# Altium schematic sheet TOP.SchDoc
size A3; DocumentNumber: 1; SheetNumber: 1; SheetTotal: 15
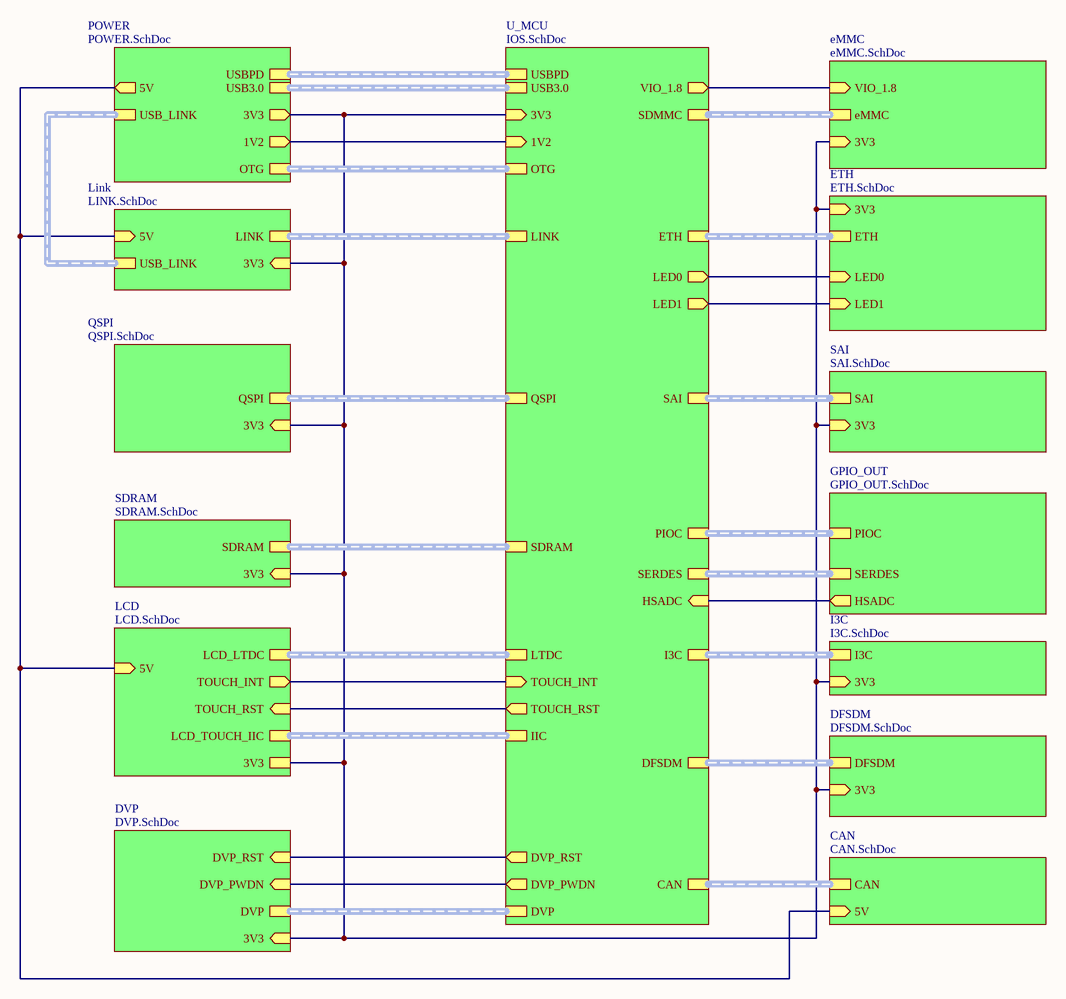
[diagram p0: TOP.SchDoc]

## Sub-sheets
CAN = CAN.SchDoc: CAN (harness CAN), 5V (in)
DFSDM = DFSDM.SchDoc: DFSDM (harness DFSDM), 3V3 (in)
DVP = DVP.SchDoc: DVP (harness DVP), DVP_RST (in), DVP_PWDN (in), 3V3 (in)
eMMC = eMMC.SchDoc: eMMC (harness eMMC), 3V3 (in), VIO_1.8 (in)
ETH = ETH.SchDoc: ETH (harness ETH), LED0 (in), LED1 (in), 3V3 (in)
GPIO_OUT = GPIO_OUT.SchDoc: PIOC (harness PIOC), SERDES (harness SERDES), HSADC (out)
I3C = I3C.SchDoc: I3C (harness I3C), 3V3 (in)
LCD = LCD.SchDoc: LCD_LTDC (harness LCD_LTDC), LCD_TOUCH_IIC (harness LCD_TOUCH_IIC), TOUCH_INT (out), TOUCH_RST (in), 3V3, 5V (in)
Link = LINK.SchDoc: LINK (harness LINK), USB_LINK (harness USB_LINK), 3V3 (in), 5V (in)
POWER = POWER.SchDoc: USB_LINK (harness USB_LINK), USB3.0 (harness USB3.0), 3V3 (out), 1V2 (out), OTG (harness OTG), 5V (out), USBPD (harness USBPD)
QSPI = QSPI.SchDoc: QSPI (harness QSPI), 3V3 (in)
SAI = SAI.SchDoc: SAI (harness SAI), 3V3 (in)
SDRAM = SDRAM.SchDoc: SDRAM (harness SDRAM), 3V3 (in)
U_MCU = IOS.SchDoc: QSPI (harness QSPI), LINK (harness LINK), SDRAM (harness SDRAM), LTDC (harness LCD_LTDC), USB3.0 (harness USB3.0), IIC (harness IIC), DVP (harness DVP), TOUCH_INT (in), TOUCH_RST (out), DVP_RST (out), DVP_PWDN (out), SDMMC (harness eMMC), ETH (harness ETH), SAI (harness SAI), I3C (harness I3C), DFSDM (harness DFSDM), 3V3 (in), 1V2 (in), LED0 (out), LED1 (out), VIO_1.8 (out), OTG (harness OTG), USBPD (harness USBPD), HSADC (in), PIOC (harness PIOC), SERDES (harness SERDES), CAN

## Nets
(unnamed): sheet POWER/3V3, sheet U_MCU/3V3, sheet Link/3V3, sheet QSPI/3V3, sheet SDRAM/3V3, sheet LCD/3V3, sheet eMMC/3V3, sheet DVP/3V3, sheet ETH/3V3, sheet SAI/3V3, sheet I3C/3V3, sheet DFSDM/3V3
(unnamed): sheet POWER/1V2, sheet U_MCU/1V2
(unnamed): sheet POWER/5V, sheet Link/5V, sheet LCD/5V, sheet CAN/5V
(unnamed): sheet U_MCU/TOUCH_INT, sheet LCD/TOUCH_INT
(unnamed): sheet U_MCU/TOUCH_RST, sheet LCD/TOUCH_RST
(unnamed): sheet U_MCU/DVP_RST, sheet DVP/DVP_RST
(unnamed): sheet U_MCU/DVP_PWDN, sheet DVP/DVP_PWDN
(unnamed): sheet U_MCU/LED0, sheet ETH/LED0
(unnamed): sheet U_MCU/LED1, sheet ETH/LED1
(unnamed): sheet U_MCU/VIO_1.8, sheet eMMC/VIO_1.8
(unnamed): sheet U_MCU/HSADC, sheet GPIO_OUT/HSADC

## Buses and harness runs
harness sheet CAN/CAN = sheet U_MCU/CAN
harness sheet DFSDM/DFSDM = sheet U_MCU/DFSDM
harness sheet DVP/DVP = sheet U_MCU/DVP
harness sheet eMMC/eMMC = sheet U_MCU/SDMMC
harness sheet ETH/ETH = sheet U_MCU/ETH
harness sheet GPIO_OUT/PIOC = sheet U_MCU/PIOC
harness sheet GPIO_OUT/SERDES = sheet U_MCU/SERDES
harness sheet I3C/I3C = sheet U_MCU/I3C
harness sheet LCD/LCD_LTDC = sheet U_MCU/LTDC
harness sheet LCD/LCD_TOUCH_IIC = sheet U_MCU/IIC
harness sheet Link/LINK = sheet U_MCU/LINK
harness sheet Link/USB_LINK = sheet POWER/USB_LINK
harness sheet POWER/OTG = sheet U_MCU/OTG
harness sheet POWER/USB3.0 = sheet U_MCU/USB3.0
harness sheet POWER/USBPD = sheet U_MCU/USBPD
harness sheet QSPI/QSPI = sheet U_MCU/QSPI
harness sheet SAI/SAI = sheet U_MCU/SAI
harness sheet SDRAM/SDRAM = sheet U_MCU/SDRAM